# Altium schematic sheet Pg10_ NAND_SDMMC Interface.SchDoc: NAND & SD CARD
size A2; DocumentNumber: 10; SheetNumber: 10; SheetTotal: 16
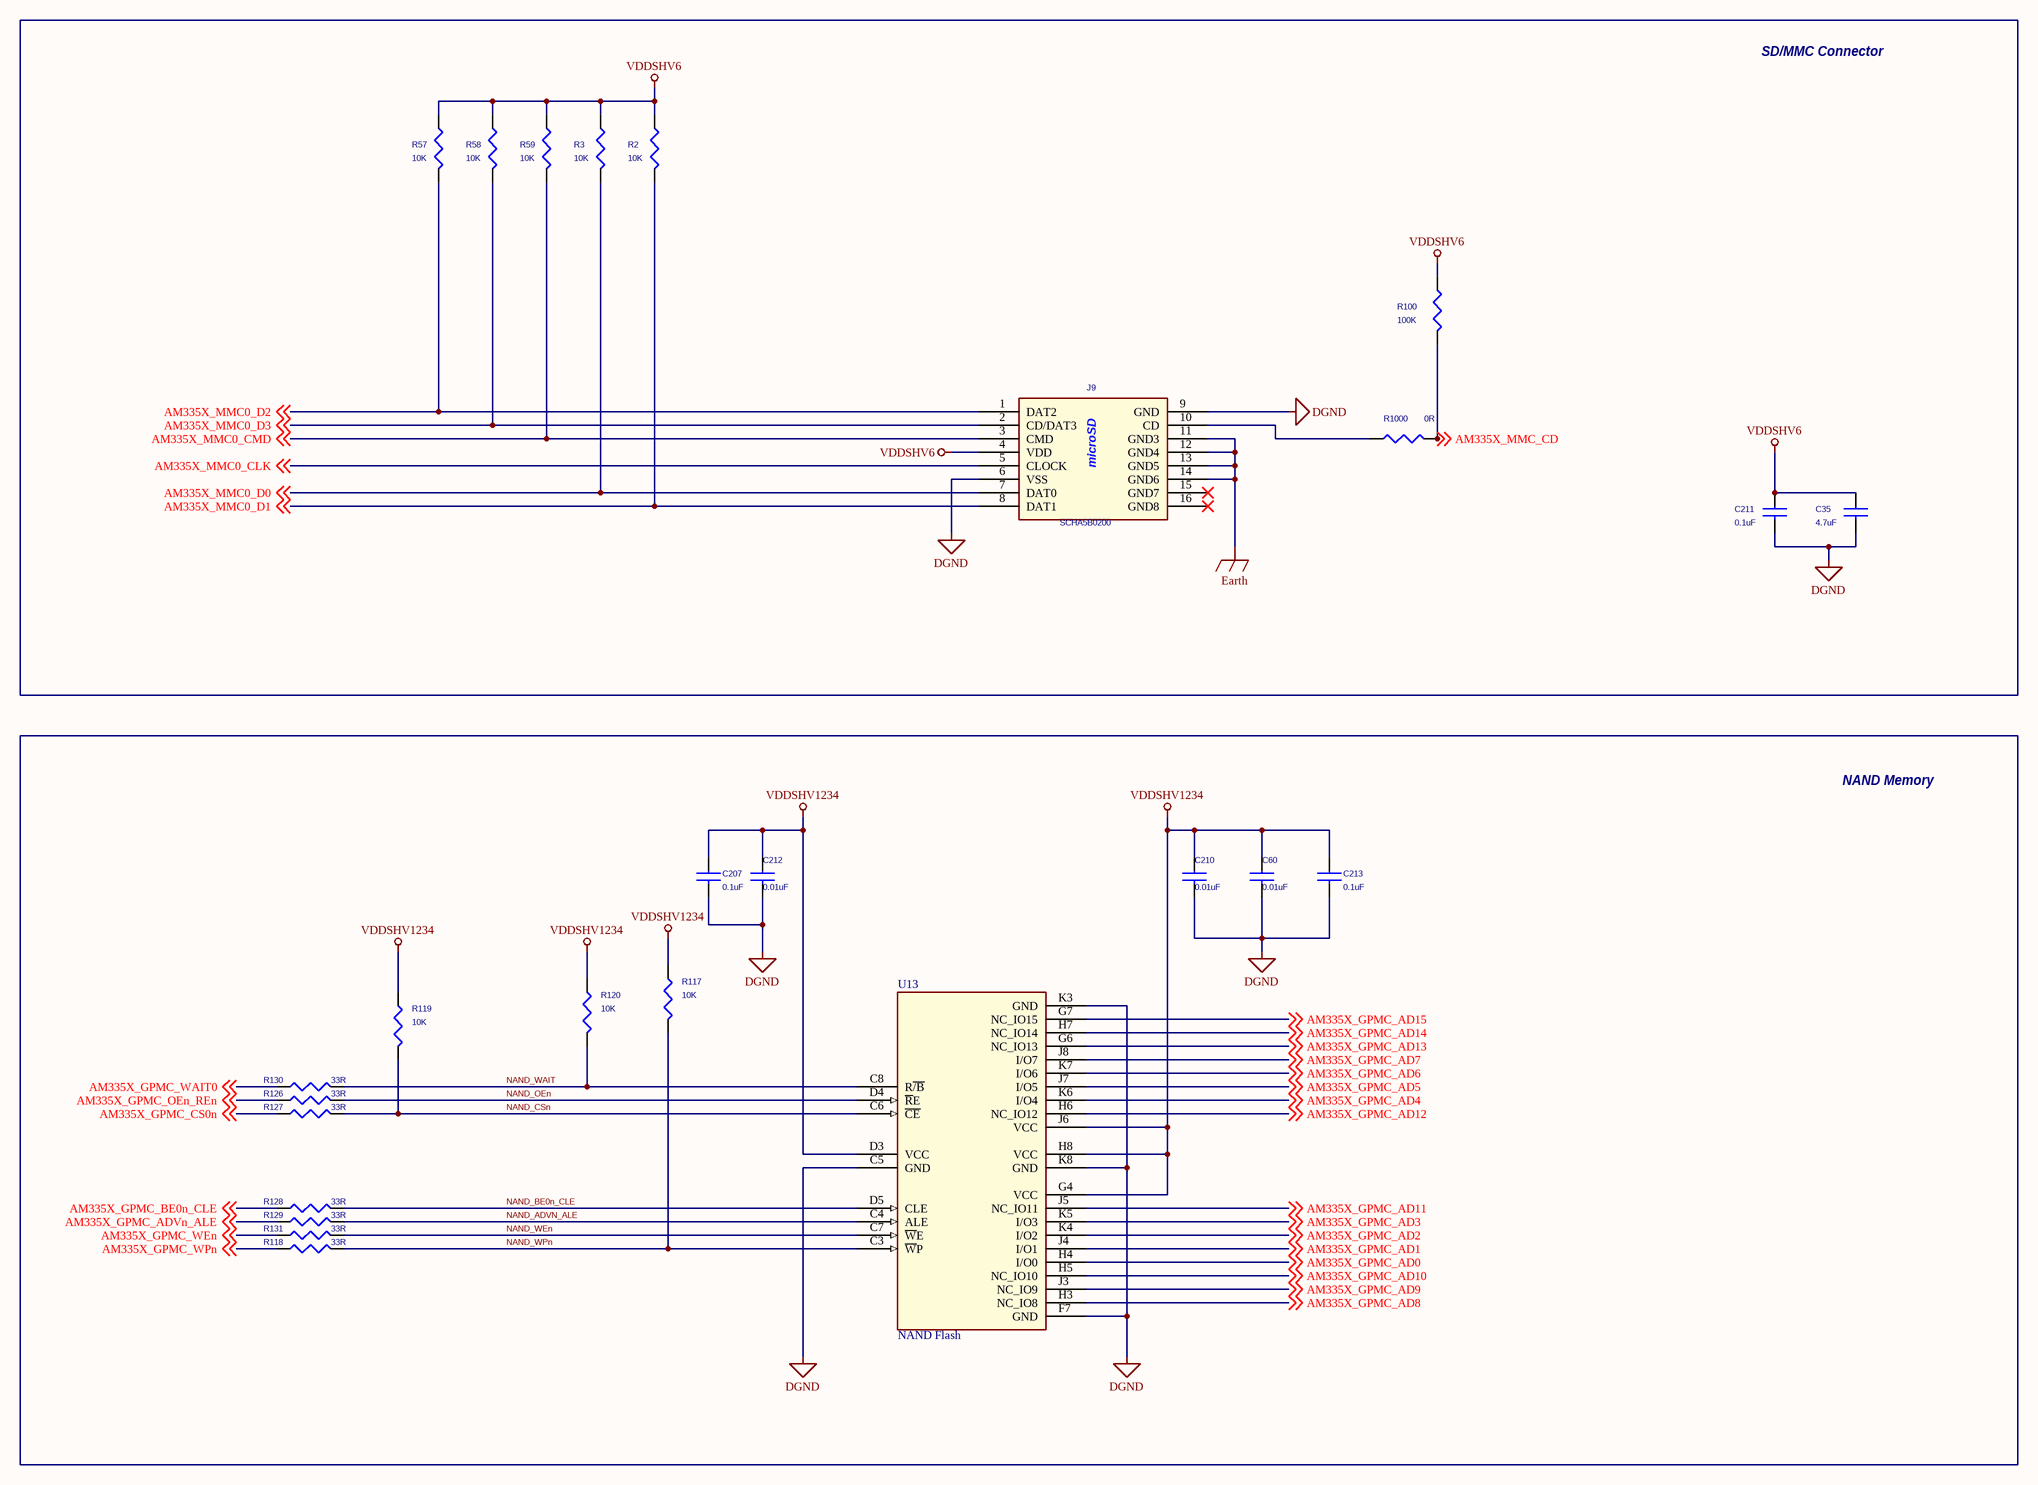
[diagram p0: Pg10_ NAND_SDMMC Interface.SchDoc]

## Parts
?  (no value)  (graphical)
C35  4.7uF  [SM-7351-CAP-0603]
C60  0.01uF  [SM-7351-CAP-0402]
C207  0.1uF  [SM-7351-CAP-0402]
C210  0.01uF  [SM-7351-CAP-0402]
C211  0.1uF  [SM-7351-CAP-0402]
C212  0.01uF  [SM-7351-CAP-0402]
C213  0.1uF  [SM-7351-CAP-0402]
J9  SCHA5B0200  [micro SD]
R2  10K  [SM-7351-RES-0402]
R3  10K  [SM-7351-RES-0402]
R57  10K  [SM-7351-RES-0402]
R58  10K  [SM-7351-RES-0402]
R59  10K  [SM-7351-RES-0402]
R100  100K  [SM-7351-RES-0402]
R117  10K  [SM-7351-RES-0402]
R118  33R  [SM-7351-RES-0402]
R119  10K  [SM-7351-RES-0402]
R120  10K  [SM-7351-RES-0402]
R126  33R  [SM-7351-RES-0402]
R127  33R  [SM-7351-RES-0402]
R128  33R  [SM-7351-RES-0402]
R129  33R  [SM-7351-RES-0402]
R130  33R  [SM-7351-RES-0402]
R131  33R  [SM-7351-RES-0402]
R1000  0R  [SM-7351-RES-0402]
U13  NAND Flash  [VFBGA - 63]

## Blocks framed on the sheet
SD/MMC Connector: C35 C211 J9 R2 R3 R57-R59 R100 R1000
NAND Memory: C60 C207 C210 C212 C213 R117-R120 R126-R131 U13

## Nets
DGND: C35.2 C60.2 C207.2 C210.2 C211.2 C212.2 C213.2 J9.6(VSS) J9.9(GND) U13.C5(GND) U13.F7(GND) U13.K3(GND) U13.K8(GND)
Earth: J9.11(GND3) J9.12(GND4) J9.13(GND5) J9.14(GND6)
VDDSHV6: C35.1 C211.1 J9.4(VDD) R2.2(P2) R3.2(P2) R57.2(P2) R58.2(P2) R59.2(P2) R100.2(P2)
VDDSHV1234: C60.1 C207.1 C210.1 C212.1 C213.1 R117.2(P2) R119.2(P2) R120.2(P2) U13.D3(VCC) U13.G4(VCC) U13.H8(VCC) U13.J6(VCC)
AM335X_GPMC_AD0: U13.H4(I/O0) ; off-sheet AM335X_GPMC_AD0
AM335X_GPMC_AD1: U13.J4(I/O1) ; off-sheet AM335X_GPMC_AD1
AM335X_GPMC_AD2: U13.K4(I/O2) ; off-sheet AM335X_GPMC_AD2
AM335X_GPMC_AD3: U13.K5(I/O3) ; off-sheet AM335X_GPMC_AD3
AM335X_GPMC_AD4: U13.K6(I/O4) ; off-sheet AM335X_GPMC_AD4
AM335X_GPMC_AD5: U13.J7(I/O5) ; off-sheet AM335X_GPMC_AD5
AM335X_GPMC_AD6: U13.K7(I/O6) ; off-sheet AM335X_GPMC_AD6
AM335X_GPMC_AD7: U13.J8(I/O7) ; off-sheet AM335X_GPMC_AD7
AM335X_GPMC_AD8: U13.H3(NC_IO8) ; off-sheet AM335X_GPMC_AD8
AM335X_GPMC_AD9: U13.J3(NC_IO9) ; off-sheet AM335X_GPMC_AD9
AM335X_GPMC_AD10: U13.H5(NC_IO10) ; off-sheet AM335X_GPMC_AD10
AM335X_GPMC_AD11: U13.J5(NC_IO11) ; off-sheet AM335X_GPMC_AD11
AM335X_GPMC_AD12: U13.H6(NC_IO12) ; off-sheet AM335X_GPMC_AD12
AM335X_GPMC_AD13: U13.G6(NC_IO13) ; off-sheet AM335X_GPMC_AD13
AM335X_GPMC_AD14: U13.H7(NC_IO14) ; off-sheet AM335X_GPMC_AD14
AM335X_GPMC_AD15: U13.G7(NC_IO15) ; off-sheet AM335X_GPMC_AD15
AM335X_GPMC_ADVn_ALE: R129.2(P2) ; off-sheet AM335X_GPMC_ADVn_ALE
AM335X_GPMC_BE0n_CLE: R128.2(P2) ; off-sheet AM335X_GPMC_BE0n_CLE
AM335X_GPMC_CS0n: R127.2(P2) ; off-sheet AM335X_GPMC_CS0n
AM335X_GPMC_OEn_REn: R126.2(P2) ; off-sheet AM335X_GPMC_OEn_REn
AM335X_GPMC_WAIT0: R130.2(P2) ; off-sheet AM335X_GPMC_WAIT0
AM335X_GPMC_WEn: R131.2(P2) ; off-sheet AM335X_GPMC_WEn
AM335X_GPMC_WPn: R118.2(P2) ; off-sheet AM335X_GPMC_WPn
AM335X_MMC0_CLK: J9.5(CLOCK) ; off-sheet AM335X_MMC0_CLK
AM335X_MMC0_CMD: J9.3(CMD) R59.1(P1) ; off-sheet AM335X_MMC0_CMD
AM335X_MMC0_D0: J9.7(DAT0) R3.1(P1) ; off-sheet AM335X_MMC0_D0
AM335X_MMC0_D1: J9.8(DAT1) R2.1(P1) ; off-sheet AM335X_MMC0_D1
AM335X_MMC0_D2: J9.1(DAT2) R57.1(P1) ; off-sheet AM335X_MMC0_D2
AM335X_MMC0_D3: J9.2(CD/DAT3) R58.1(P1) ; off-sheet AM335X_MMC0_D3
AM335X_MMC_CD: R100.1(P1) R1000.1(P1) ; off-sheet AM335X_MMC_CD
NAND_ADVN_ALE: R129.1(P1) U13.C4(ALE)
NAND_BE0n_CLE: R128.1(P1) U13.D5(CLE)
NAND_CSn: R119.1(P1) R127.1(P1) U13.C6(~{CE})
NAND_OEn: R126.1(P1) U13.D4(~{R}E)
NAND_WAIT: R120.1(P1) R130.1(P1) U13.C8(R~{/B})
NAND_WEn: R131.1(P1) U13.C7(~{W}E)
NAND_WPn: R117.1(P1) R118.1(P1) U13.C3(~{W}P)
NetJ9_10: J9.10(CD) R1000.2(P2)

Not connected (* = marked no-connect by the designer): J9 15(GND7)* 16(GND8)*

## Notes on the sheet
- Embedded Vision Systems Group
- Title
- School of Electrical and Electronic Engineering
- Date:
- Size
- Document Number
- Sheet
- of
- Rev
- (in symbol Conn_microSD_8) microSD

## Library data of the parts
? = Title Block Address(1): UoM title block
C35 = 4.7uFCapacitor16V10%0603: TIIntPartnumber: 1C0103; MfrNum: EMK107ABJ475KA-T; Mfr: Taiyo Yuden; PartName: 4.7uF16V10%SMD0603; Cost10K: 0.00590; Cost100: 0.0198; Vendor: Digikey; DescriptiveText: Capacitor Ceramic 4.7uF 16V 10% 0603
C60 C210 C212 = 0.01uFCapacitor16V10%0402: TIIntPartnumber: 1C0012; MfrNum: ECJ-0YB1C103K; PartName: 0.01uF16V10%SMD0402; Mfr: Panasonic; DescriptiveText: Capacitor 0.01uF 16V 10% 0402; Cost10K: 0.015; Cost100: 0.00; Vendor: Digikey; TN: 207-0054-000; PN: 0402YC103KAT2A
C207 C213 = 0.1uFCapacitor16V10%0402: TIIntPartnumber: 1C0089; MfrNum: C0402C104K4RACT; Mfr: Kemet; PartName: 0.1uF16V10%SMD0402; DescriptiveText: Capacitor 0.1uF 16V 10% 0402 X7R; Cost10K: 0.015; Cost100: 0.11; Vendor: Digikey
C211 = 0.1uFCapacitor16V10%0402_Dup1: TIIntPartnumber: 1C0089; MfrNum: C0402C104K4RACT; Mfr: Kemet; PartName: 0.1uF16V10%SMD0402; DescriptiveText: Capacitor 0.1uF 16V 10% 0402 X7R; Cost10K: 0.015; Cost100: 0.11; Vendor: Digikey
J9 = Conn_microSD_8: TIIntPartnumber: 2C0102; Mfr: ALPS; PartName: Conn_microSD_SCHA5B0200; DescriptiveText: Connector compact low-profile Push Type Micro SD; Cost10K: x.00; Vendor: Mouser; Cost100: x.00; MfrNum: SCHA5B0200
R2 R3 R57-R59 = 10KOhmResistor1/16W0402_Dup1: Resistor 10Kohm 1/16W 5% 0402; TIIntPartnumber: 1R0168; MfrNum: MCR01MZPJ103; Mfr: Rohm; PartName: 10Kohm1/16W5%SMD0402; Cost10K: 0.0017; Cost100: 0.03; Vendor: Digikey; Descriptive_Text: Resistor 10Kohm 1/16W 5% 0402; DescriptiveText: Resistor 10Kohm 1/16W 5% 0402
R100 R1000 = 470Kohm1/16W1%SMD0402: Resistor 470Kohm 1/16W 1% 0402; TIIntPartnumber: 1R0190; MfrNum: RMCF0402FT470K; Mfr: Stackpole Electronics; Cost10K: 0.00275; Cost100: 0.0105; Vendor: Digikey; DescriptiveText: Resistor 470Kohm 1/16W 1% 0402; PartName: 470Kohm1/16W1%SMD0402; Descriptive_Text: Resistor 470Kohm 1/16W 1% 0402
R117-R120 R126-R131 = 10KOhmResistor1/16W0402: TIIntPartnumber: 1R0168; MfrNum: MCR01MZPJ103; Mfr: Rohm; PartName: 10Kohm1/16W5%SMD0402; Cost10K: 0.0017; Cost100: 0.03; Vendor: Digikey; DescriptiveText: Resistor 10Kohm 1/16W 5% 0402
U13 = NAND Flash: MT29F2Gxx; PartNumber: 557-1486-2-ND; Seller: Digikey; Supplier: MT29F2Gxx